# EAGLE schematic parts_servo (EAGLE 6.6.0)
TITLE: Servo Driver; VERSION: 1.a
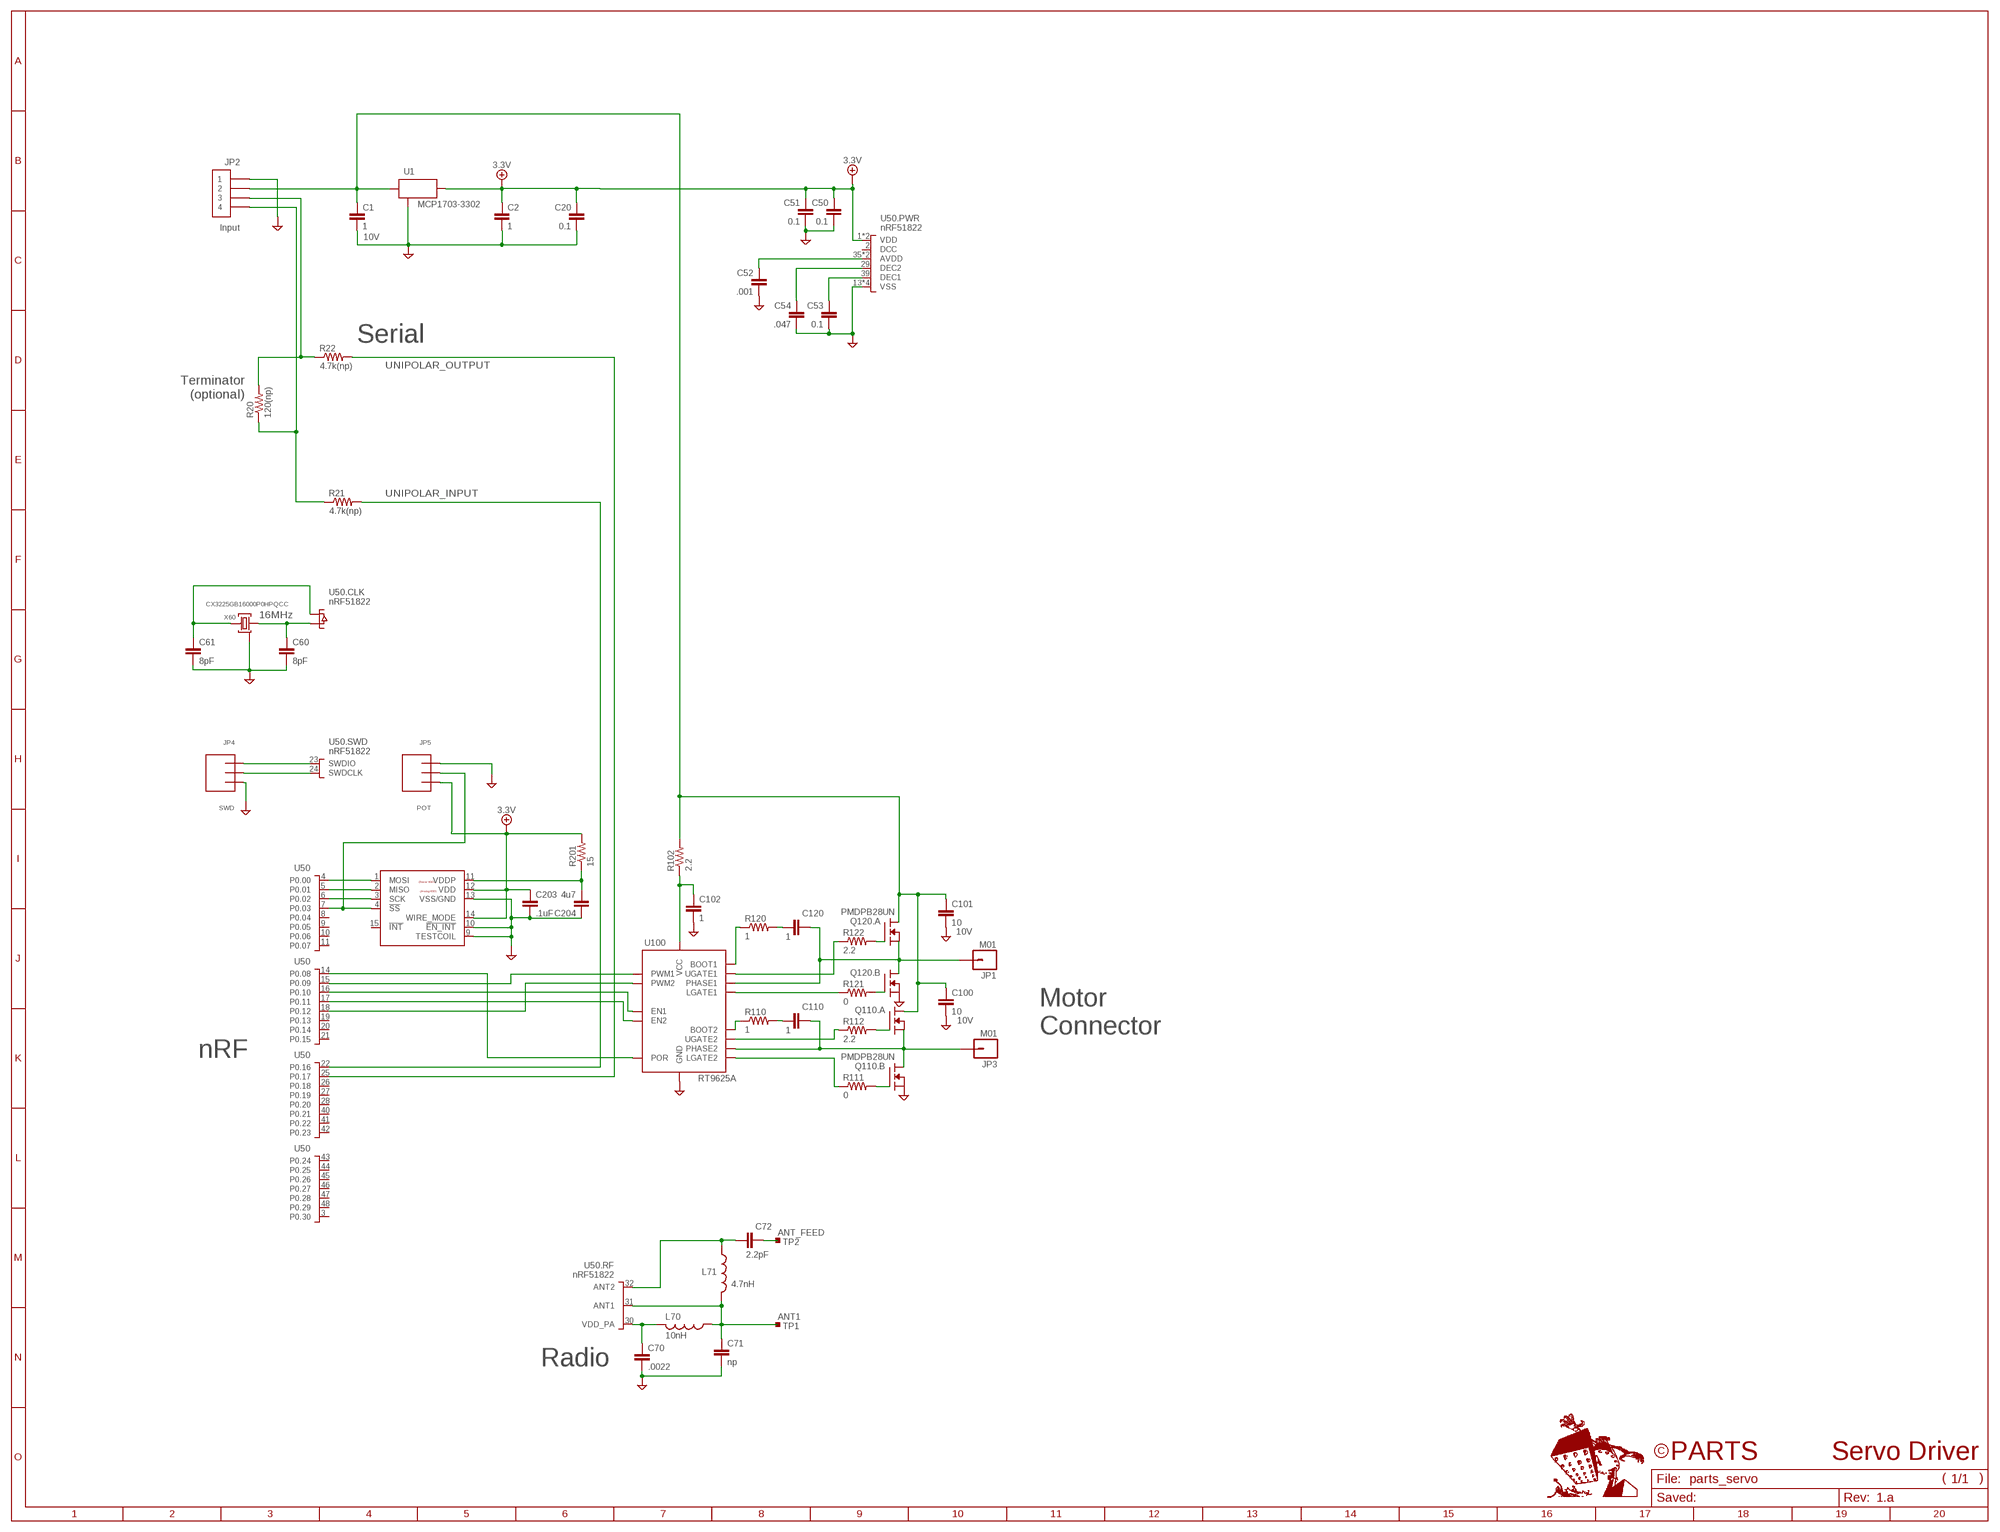
[diagram p0: schematic, sheet 1]

## Parts
C1  1  C-EU0402-B  [0402-B]
C2  1  C-EU0402-B  [0402-B]
C20  0.1  C-EU0402-B  [0402-B]
C50  0.1  C-EU0402-B  [0402-B]
C51  0.1  C-EU0402-B  [0402-B]
C52  .001  C-EU0402-B  [0402-B]
C53  0.1  C-EU0402-B  [0402-B]
C54  .047  C-EU0402-B  [0402-B]
C60  8pF  C-EU0402-B  [0402-B]
C61  8pF  C-EU0402-B  [0402-B]
C70  .0022  C-EU0402-B  [0402-B]
C71  np  C-EU0402-B  [0402-B]
C72  2.2pF  C-EU0402-B  [0402-B]
C100  10  C-EU0805-B  [0805-B]
C101  10  C-EU0805-B  [0805-B]
C102  1  C-EU0402-B  [0402-B]
C110  1  C-EU0402-B  [0402-B]
C120  1  C-EU0402-B  [0402-B]
C203  .1uF  C-EU0402-B  [0402-B]
C204  4u7  C-EU0402-B  [0402-B]
JP1  M01  [SMDMOTOR]
JP2  Input  SMD_1X4_HEADER  [SMD_1X4_HEADER]
JP3  M01  [SMDMOTOR]
JP4  SWD  SMD_1X3_HEADER  [SMD_1X3_HEADER]
JP5  POT  SMD_1X3_HEADERSMDLARGEPADS  [SMD_1X3_PADS]
L70  10nH  L-US0402-B  [0402-B]
L71  4.7nH  L-US0402-B  [0402-B]
Q110  PMDPB28UN  NFET-DUAL-DFN-6(2X2)+2PADS  [DFN-6(2X2)+2EP(TRANSISTOR)]
Q120  PMDPB28UN  NFET-DUAL-DFN-6(2X2)+2PADS  [DFN-6(2X2)+2EP(TRANSISTOR)]
R20  120(np)  R-US_0402-B  [0402-B]
R21  4.7k(np)  R-US_0402-B  [0402-B]
R22  4.7k(np)  R-US_0402-B  [0402-B]
R102  2.2  R-US_0402-B  [0402-B]
R110  1  R-US_0402-B  [0402-B]
R111  0  R-US_0402-B  [0402-B]
R112  2.2  R-US_0402-B  [0402-B]
R120  1  R-US_0402-B  [0402-B]
R121  0  R-US_0402-B  [0402-B]
R122  2.2  R-US_0402-B  [0402-B]
R201  15  R-US_0402-B  [0402-B]
TP1  ANT1  TESTPAD-(1X1)CREAMED  [TESTPOINT-(1X1)CREAMED]
TP2  ANT_FEED  TESTPAD-(1X1)CREAMED  [TESTPOINT-(1X1)CREAMED]
U1  MCP1703-3302  VOLTAGE_REGULATOR-3_TERMINAL  [DFN-8(2X3)+EP]
U50  nRF51822  NRF51822-QFN-48(6X6)  [DFN-48(6X6)+EP]
U100  RT9625A  HALF_BRIDGE_DRIVER-DUAL-QFN-16(4X4)  [QFN-16(4X4)+EP]
U200  AS5050  [QFN16_4X4]
X60  CX3225GB16000P0HPQCC  CRYSTAL_SHIELDED-3.2X2.5  [CRYSTAL-3.2X2.5(4_TERMINAL)]

## Nets
3.3V: C2.1 C20.1 C50.1 C51.1 C203.1 JP5.3 R201.2 U1.1(OUT) U50.1(.PWR:VDD) U50.12(.PWR:VDD) U200.12(VDD) U200.14(WIRE_MODE)
ANT1: C71.1 L70.1 L71.2 TP1.TP U50.31(.RF:ANT1)
ANT2: C72.1 L71.1 U50.32(.RF:ANT2)
ANT_FEED: C72.2 TP2.TP
AVDD: C52.1 U50.35(.PWR:AVDD) U50.36(.PWR:AVDD)
BOOT1: R120.1 U100.8(BOOT1)
BOOT1_SNUB: C120.1 R120.2
BOOT1_SNUB1: C110.1 R110.2
BOOT2: R110.1 U100.1(BOOT2)
D1/TX: JP2.3 R20.2 R22.1
D2/RX: JP2.4 R20.1 R21.1
DEC1: C53.1 U50.39(.PWR:DEC1)
DEC2: C54.1 U50.29(.PWR:DEC2)
GND: C1.2 C2.2 C20.2 C50.2 C51.2 C52.2 C53.2 C54.2 C60.2 C61.2 C70.2 C71.2 C100.2 C101.2 C102.2 C203.2 C204.1 JP2.1 JP4.P$3 JP5.1 Q110.4(.B:S) Q120.4(.B:S) U1.4(GND) U1.PAD(GND) U50.13(.PWR:VSS) U50.33(.PWR:VSS) U50.34(.PWR:VSS) U50.PAD(.PWR:VSS) U100.2(GND) U100.13(GND) U100.PAD(GND) U200.9(TESTCOIL) U200.10(!EN_INT) U200.13(VSS/GND) X60.2(SHIELD) X60.4(SHIELD)
HSCLK_IN: C60.1 U50.37(.CLK:CLKIN) X60.1
HSCLK_OUT: C61.1 U50.38(.CLK:CLKOUT) X60.3
LGATE1: R121.1 U100.11(LGATE1)
LGATE2: R111.1 U100.14(LGATE2)
MOTOR1: C120.2 JP1.1 Q120.1(.A:S) Q120.3(.B:D) Q120.P8(.B:D) U100.10(PHASE1)
MOTOR2: C110.2 JP3.1 Q110.1(.A:S) Q110.3(.B:D) Q110.P8(.B:D) U100.15(PHASE2)
N$1: U50.4(P0.00-07:P0.00) U200.1(MOSI)
N$3: U50.5(P0.00-07:P0.01) U200.2(MISO)
N$4: U50.6(P0.00-07:P0.02) U200.3(SCK)
N$5: JP5.2 U50.7(P0.00-07:P0.03) U200.4(!SS)
N$6: C204.2 R201.1 U200.11(VDDP)
POWER_IN: C1.1 C100.1 C101.1 JP2.2 Q110.6(.A:D) Q110.P7(.A:D) Q120.6(.A:D) Q120.P7(.A:D) R102.2 U1.8(IN)
PWM1: U50.15(P0.08-15:P0.09) U100.6(PWM1)
PWM1_EN: U50.16(P0.08-15:P0.10) U100.5(EN1)
PWM2: U50.18(P0.08-15:P0.12) U100.3(PWM2)
PWM2_EN: U50.17(P0.08-15:P0.11) U100.4(EN2)
PWM_POR: U50.14(P0.08-15:P0.08) U100.7(POR)
PWM_VCC: C102.1 R102.1 U100.12(VCC)
QLGATE1: Q120.5(.B:G) R121.2
QLGATE2: Q110.5(.B:G) R111.2
QUGATE1: Q120.2(.A:G) R122.2
QUGATE2: Q110.2(.A:G) R112.2
SWDCLK: JP4.P$2 U50.24(.SWD:SWDCLK)
SWDIO: JP4.P$1 U50.23(.SWD:SWDIO)
UGATE1: R122.1 U100.9(UGATE1)
UGATE2: R112.1 U100.16(UGATE2)
UNIPOLAR_INPUT: R21.2 U50.22(P0.16-23:P0.16)
UNIPOLAR_OUTPUT: R22.2 U50.25(P0.16-23:P0.17)
VDD_PA: C70.1 L70.2 U50.30(.RF:VDD_PA)
Unconnected: U50.2(.PWR:DCC) U50.3(P0.24-31:P0.30) U50.8(P0.00-07:P0.04) U50.9(P0.00-07:P0.05) U50.10(P0.00-07:P0.06) U50.11(P0.00-07:P0.07) U50.19(P0.08-15:P0.13) U50.20(P0.08-15:P0.14) U50.21(P0.08-15:P0.15) U50.26(P0.16-23:P0.18) U50.27(P0.16-23:P0.19) U50.28(P0.16-23:P0.20) U50.40(P0.16-23:P0.21) U50.41(P0.16-23:P0.22) U50.42(P0.16-23:P0.23) U50.43(P0.24-31:P0.24) U50.44(P0.24-31:P0.25) U50.45(P0.24-31:P0.26) U50.46(P0.24-31:P0.27) U50.47(P0.24-31:P0.28) U50.48(P0.24-31:P0.29) U200.15(!INT)

## Notes on the sheet
- Serial
- Terminator
  (optional)
- Motor
  Connector
- nRF
- Radio

## Library data of the parts
C1 C100 C101 = rcl_custom:C-EU: CAPACITOR, European symbol; VOLTAGE: 10V
C2 C20 C50-C54 C60 C61 C70-C72 C102 C110 C120 C203 C204 = rcl_custom:C-EU: CAPACITOR, European symbol
JP1 JP3 = parts_servo:M01: Header 1 Standard 1-pin 0.1" header. Use with straight break away headers (SKU : PRT-00116), right angle break away headers (PRT-00553), swiss pins (PRT-00743), machine pins (PRT-00117), and female headers (PRT-00115).
JP2 = parts_servo:SMD_1X4_HEADER: SMD 1x4 SMD 0.1" Header
JP4 JP5 = parts_servo:SMD_1X3_HEADER: SMD 1x3 Header
L70 L71 = rcl_custom:L-US: INDUCTOR, American symbol
Q110 Q120 = parts_servo:NFET-DUAL: Generic Dual NFET
R20-R22 R102 R110-R112 R120-R122 R201 = rcl_custom:R-US_: RESISTOR, American symbol
TP1 TP2 = parts_servo:TESTPAD: Testpad with solid rectangle symbol. Denotes a small testpad, possibly not for pogos.
U1 = parts_servo:VOLTAGE_REGULATOR-3_TERMINAL: Generic fixed output 3 terminal voltage regulator Attribute (>VOut) shows the output voltage; VOUT: 3.3V
U50 = parts_servo:NRF51822: Nordic nRF51822 RF SoC; SWDIO: (nRST)
U100 = parts_servo:HALF_BRIDGE_DRIVER-DUAL: Generic dual half bridge driver. This is modeled on the Richtek RT9625A, but is sufficiently generic that it may apply to other parts.
U200 = parts_servo:AS5050
X60 = parts_servo:CRYSTAL_SHIELDED: Generic 4 pin crystal; FREQUENCY: 16MHz